# Altium project sensor.PrjPcb
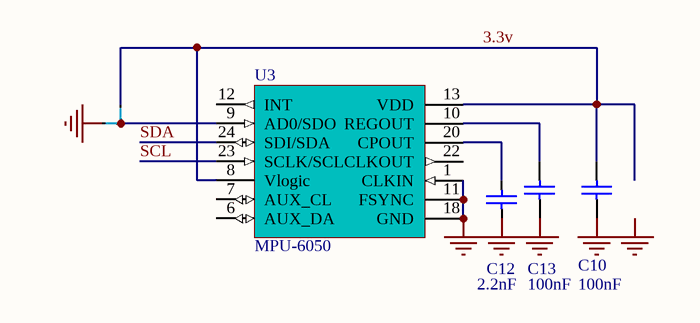
[diagram p0: mpu6050.SchDoc]
1 sheet, 6 parts. Net scope: global (net labels, ports and power ports of the same name join across sheets).
Board file: mpu6050.PcbDoc

## Sheet mpu6050.SchDoc
size A4

### Parts
(Parts that share a designator on the sheet are numbered #1, #2 ... from top to bottom, then left to right.)
C10  value 100nF  [0402x]  (hidden comment: Cap402)
C12  value 2.2nF  [0402x]  (hidden comment: Cap603)
C13  value 100nF  [0603x]  (hidden comment: Cap402)
NT?#1  NET_TIE  [NET_TIE]  (value not drawn)  (net tie, no BOM)
NT?#2  NET_TIE  [NET_TIE]  (value not drawn)  (net tie, no BOM)
U3  MPU-6050  [IMU-3000]

### Nets
GND: C10.1 C12.1 C13.2 NT?#2.2 U3.1(CLKIN) U3.11(FSYNC) U3.18(GND)
3.3v: C10.2 NT?#1.2 U3.8(Vlogic) U3.13(VDD)
SCL: U3.23(SCLK/SCL)
SDA: U3.24(SDI/SDA)
NetC12_2: C12.2 U3.20(CPOUT)
NetC13_1: C13.1 U3.10(REGOUT)
NetNT?#1_1: NT?#1.1 NT?#2.1 U3.9(AD0/SDO)

Not connected (* = marked no-connect by the designer): U3 2(NC) 3(NC) 4(NC) 5(NC) 6(AUX_DA) 7(AUX_CL) 12(INT) 14(NC) 15(NC) 16(NC) 17(NC) 19(RESV) 21(RESV) 22(CLKOUT)

### Notes on the sheet
- Labels drawn without touching a wire or pin: GND

### Library data of the parts
C10 C13 = Cap402: Capacitor SMD; Published: 1-Nov-2010; LatestRevisionDate: 1-Nov-2010; LatestRevisionNote: Released OpenPilot Lib; PackageReference: 0402 (1005 Metric); Publisher: The OpenPilot Project; ComponentLink2Description: Datasheet; Supplier 1: Digi-Key; Supplier Part Number 1: 445-4952-1-ND
C12 = Cap603: Capacitor SMD; Published: 1-Nov-2010; LatestRevisionDate: 1-Nov-2010; LatestRevisionNote: Released OpenPilot Lib; PackageReference: 0603 (1608 Metric); Publisher: The OpenPilot Project; Supplier 1: Digi-Key; Supplier Part Number 1: 445-1309-1-ND
NT?#1 NT?#2 = Net tie
U3 = MPU-6050: Invensense MPU-6050  3-axis Gyros & Accel; ComponentLink2Description: Datasheet; LatestRevisionDate: 1-Nov-2010; LatestRevisionNote: Released OpenPilot Lib; Published: 1-Nov-2010; Publisher: The OpenPilot Project; Manufacturer: Invensense; Supplier 1: Invensense; Supplier Part Number 1: MPU-6000